# Altium project SSLMainPCB VIII.PrjPcb
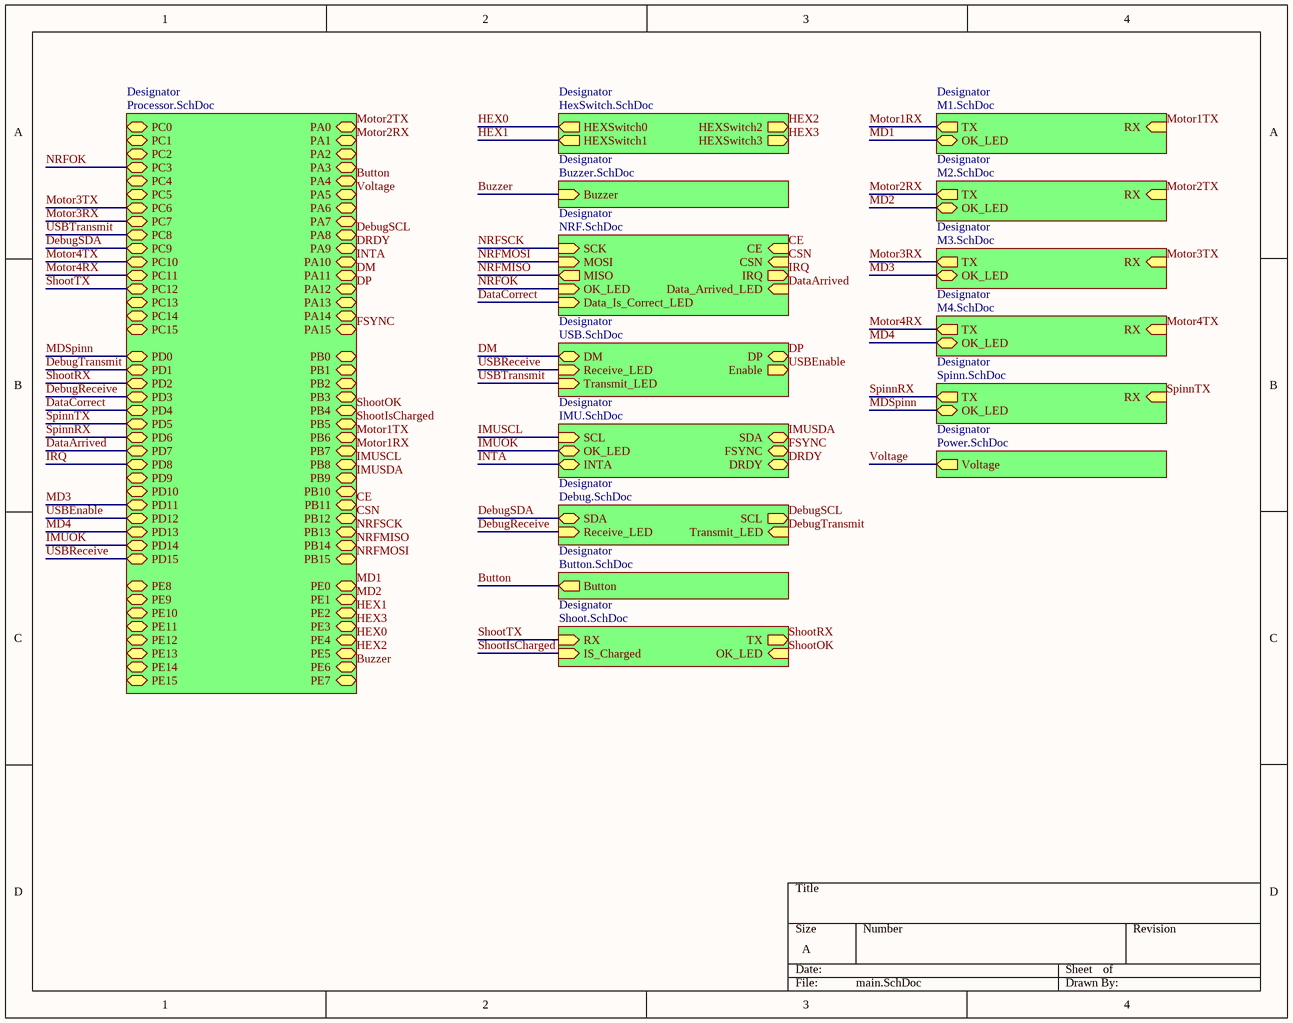
[diagram p0: main.SchDoc]
20 sheets, 167 parts. Net scope: hierarchical (ports join the sheet entries above them; power ports are global).
Board files: main.PcbDoc, Sheet.PcbDoc
Sheets:
  main.SchDoc
    Designator = Processor.SchDoc
      Designator = STLink.SchDoc
      Designator = Boot.SchDoc
      Designator = Reset.SchDoc
      Designator = Xtal.SchDoc
    Designator = HexSwitch.SchDoc
    Designator = Buzzer.SchDoc
    Designator = NRF.SchDoc
    Designator = USB.SchDoc
    Designator = IMU.SchDoc
    Designator = Button.SchDoc
    Designator = Debug.SchDoc
    Designator = Shoot.SchDoc
    Designator = M1.SchDoc
    Designator = M2.SchDoc
    Designator = M3.SchDoc
    Designator = M4.SchDoc
    Designator = Spinn.SchDoc
    Designator = Power.SchDoc

## Sheet main.SchDoc: SSLMainPCB VIII
size A

### Sub-sheets
Designator = Processor.SchDoc: PA0 (bidir), PA1 (bidir), PA2 (bidir), PA3 (bidir), PA4 (bidir), PA5 (bidir), PA6 (bidir), PA7 (bidir), PA8 (bidir), PA9 (bidir), PA10 (bidir), PA11 (bidir), PA12 (bidir), PA13 (bidir), PA14 (bidir), PA15 (bidir), PB0 (bidir), PB1 (bidir), PB2 (bidir), PB3 (bidir), PB4 (bidir), PB5 (bidir), PB6 (bidir), PB7 (bidir), PB8 (bidir), PB9 (bidir), PB10 (bidir), PB11 (bidir), PB12 (bidir), PB13 (bidir), PB14 (bidir), PB15 (bidir), PC0 (bidir), PC1 (bidir), PC2 (bidir), PC3 (bidir), PC4 (bidir), PC5 (bidir), PC6 (bidir), PC7 (bidir), PC8 (bidir), PC9 (bidir), PC10 (bidir), PC11 (bidir), PC12 (bidir), PC13 (bidir), PC14 (bidir), PC15 (bidir), PD0 (bidir), PD1 (bidir), PD2 (bidir), PD3 (bidir), PD4 (bidir), PD5 (bidir), PD6 (bidir), PD7 (bidir), PD8 (bidir), PD9 (bidir), PD10 (bidir), PD11 (bidir), PD12 (bidir), PD13 (bidir), PD14 (bidir), PD15 (bidir), PE1 (bidir), PE2 (bidir), PE3 (bidir), PE4 (bidir), PE5 (bidir), PE6 (bidir), PE7 (bidir), PE8 (bidir), PE9 (bidir), PE10 (bidir), PE11 (bidir), PE12 (bidir), PE13 (bidir), PE14 (bidir), PE15 (bidir), PE0 (bidir)
Designator = HexSwitch.SchDoc: HEXSwitch0 (out), HEXSwitch1 (out), HEXSwitch2 (out), HEXSwitch3 (out)
Designator = Buzzer.SchDoc: Buzzer (in)
Designator = NRF.SchDoc: SCK (in), MOSI (in), MISO (out), CE (in), CSN (in), IRQ (out), OK_LED (in), Data_Is_Correct_LED (in), Data_Arrived_LED (in)
Designator = USB.SchDoc: DM (bidir), DP (bidir), Receive_LED (in), Transmit_LED (in), Enable (out)
Designator = IMU.SchDoc: SCL (in), SDA, OK_LED, INTA, FSYNC, DRDY
Designator = Button.SchDoc: Button (out)
Designator = Debug.SchDoc: SDA (bidir), SCL (out), Receive_LED (in), Transmit_LED (in)
Designator = Shoot.SchDoc: RX (in), IS_Charged (in), TX (out), OK_LED (in)
Designator = M1.SchDoc: TX (out), OK_LED, RX (in)
Designator = M2.SchDoc: TX (out), OK_LED, RX (in)
Designator = M3.SchDoc: TX (out), OK_LED, RX (in)
Designator = M4.SchDoc: TX (out), OK_LED, RX (in)
Designator = Spinn.SchDoc: TX (out), OK_LED, RX (in)
Designator = Power.SchDoc: Voltage (out)

### Nets
Button: sheet Designator/PA4, sheet Designator/Button
Buzzer: sheet Designator/PE6, sheet Designator/Buzzer
CE: sheet Designator/PB11, sheet Designator/CE
CSN: sheet Designator/PB12, sheet Designator/CSN
DataArrived: sheet Designator/PD7, sheet Designator/Data_Arrived_LED
DataCorrect: sheet Designator/PD4, sheet Designator/Data_Is_Correct_LED
DebugReceive: sheet Designator/PD3, sheet Designator/Receive_LED
DebugSCL: sheet Designator/PA8, sheet Designator/SCL
DebugSDA: sheet Designator/PC9, sheet Designator/SDA
DebugTransmit: sheet Designator/PD1, sheet Designator/Transmit_LED
DM: sheet Designator/PA11, sheet Designator/DM
DP: sheet Designator/PA12, sheet Designator/DP
DRDY: sheet Designator/PA9, sheet Designator/DRDY
FSYNC: sheet Designator/PA15, sheet Designator/FSYNC
HEX0: sheet Designator/PE4, sheet Designator/HEXSwitch0
HEX1: sheet Designator/PE2, sheet Designator/HEXSwitch1
HEX2: sheet Designator/PE5, sheet Designator/HEXSwitch2
HEX3: sheet Designator/PE3, sheet Designator/HEXSwitch3
IMUOK: sheet Designator/PD14, sheet Designator/OK_LED
IMUSCL: sheet Designator/PB8, sheet Designator/SCL
IMUSDA: sheet Designator/PB9, sheet Designator/SDA
INTA: sheet Designator/PA10, sheet Designator/INTA
IRQ: sheet Designator/PD8, sheet Designator/IRQ
MD1: sheet Designator/PE0, sheet Designator/OK_LED
MD2: sheet Designator/PE1, sheet Designator/OK_LED
MD3: sheet Designator/PD11, sheet Designator/OK_LED
MD4: sheet Designator/PD13, sheet Designator/OK_LED
MDSpinn: sheet Designator/PD0, sheet Designator/OK_LED
Motor1RX: sheet Designator/PB7, sheet Designator/TX
Motor1TX: sheet Designator/PB6, sheet Designator/RX
Motor2RX: sheet Designator/PA1, sheet Designator/TX
Motor2TX: sheet Designator/PA0, sheet Designator/RX
Motor3RX: sheet Designator/PC7, sheet Designator/TX
Motor3TX: sheet Designator/PC6, sheet Designator/RX
Motor4RX: sheet Designator/PC11, sheet Designator/TX
Motor4TX: sheet Designator/PC10, sheet Designator/RX
NRFMISO: sheet Designator/PB14, sheet Designator/MISO  [project net MISO]
NRFMOSI: sheet Designator/PB15, sheet Designator/MOSI  [project net MOSI]
NRFOK: sheet Designator/PC3, sheet Designator/OK_LED
NRFSCK: sheet Designator/PB13, sheet Designator/SCK
ShootIsCharged: sheet Designator/PB5, sheet Designator/IS_Charged
ShootOK: sheet Designator/PB4, sheet Designator/OK_LED
ShootRX: sheet Designator/PD2, sheet Designator/TX
ShootTX: sheet Designator/PC12, sheet Designator/RX  [project net RX]
SpinnRX: sheet Designator/PD6, sheet Designator/TX
SpinnTX: sheet Designator/PD5, sheet Designator/RX  [project net RX]
USBEnable: sheet Designator/PD12, sheet Designator/Enable
USBReceive: sheet Designator/PD15, sheet Designator/Receive_LED
USBTransmit: sheet Designator/PC8, sheet Designator/Transmit_LED
Voltage: sheet Designator/PA5, sheet Designator/Voltage

## Sheet Processor.SchDoc
size A
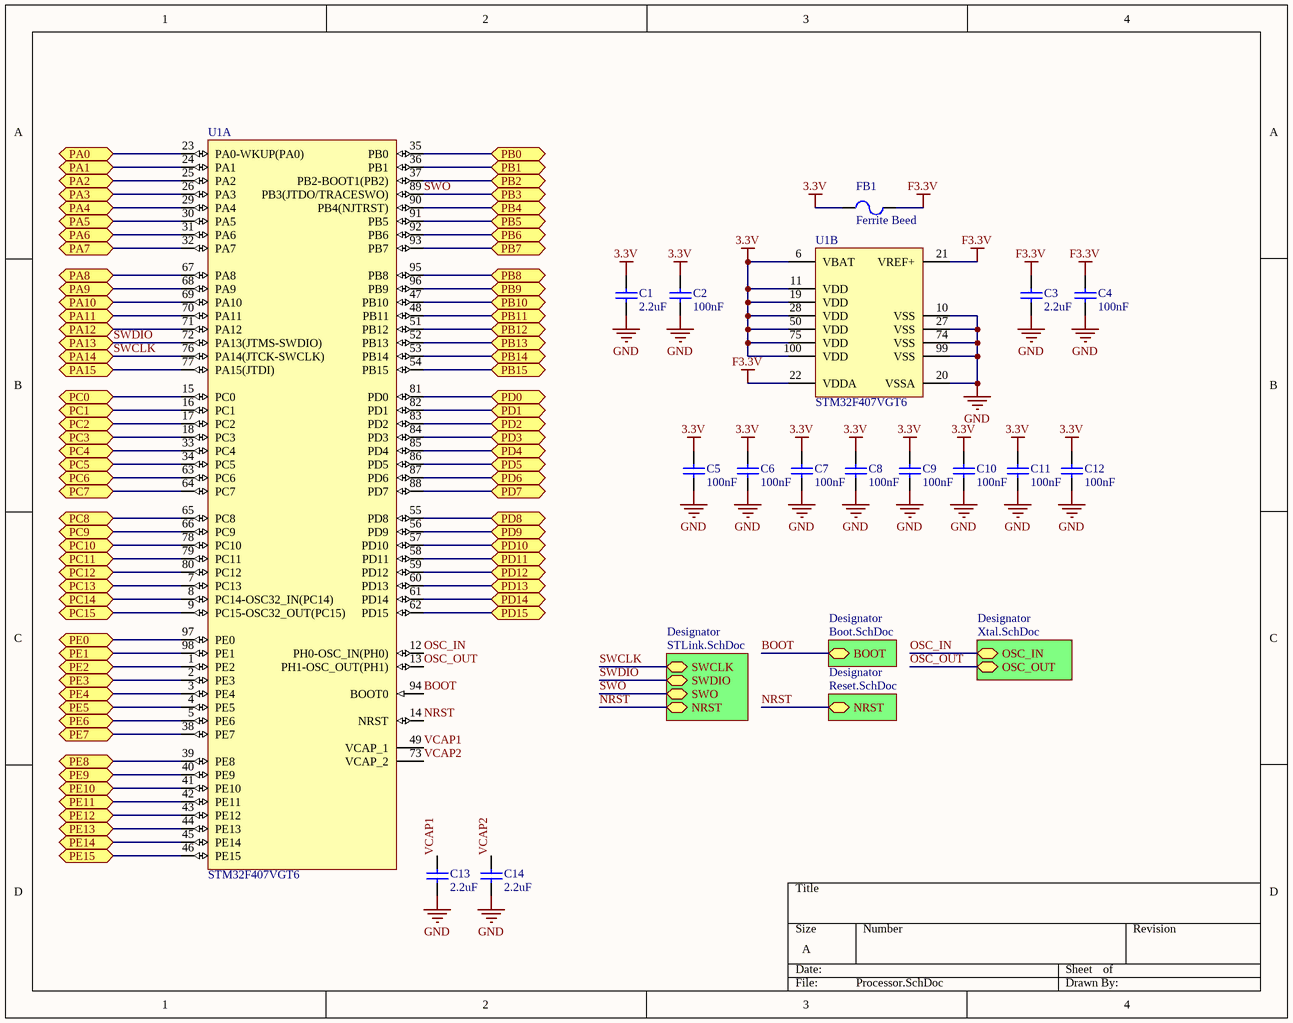
[diagram p1: Processor.SchDoc]

### Parts
C1  value 2.2uF  [2012[0805]]  (hidden comment: Cap_UP)
C2  value 100nF  [2012[0805]]  (hidden comment: Cap_UP)
C3  value 2.2uF  [2012[0805]]  (hidden comment: Cap_UP)
C4  value 100nF  [2012[0805]]  (hidden comment: Cap_UP)
C5  value 100nF  [2012[0805]]  (hidden comment: Cap_UP)
C6  value 100nF  [2012[0805]]  (hidden comment: Cap_UP)
C7  value 100nF  [2012[0805]]  (hidden comment: Cap_UP)
C8  value 100nF  [2012[0805]]  (hidden comment: Cap_UP)
C9  value 100nF  [2012[0805]]  (hidden comment: Cap_UP)
C10  value 100nF  [2012[0805]]  (hidden comment: Cap_UP)
C11  value 100nF  [2012[0805]]  (hidden comment: Cap_UP)
C12  value 100nF  [2012[0805]]  (hidden comment: Cap_UP)
C13  value 2.2uF  [2012[0805]]  (hidden comment: Cap_UP)
C14  value 2.2uF  [2012[0805]]  (hidden comment: Cap_UP)
FB1  Ferrite Beed  [3216[1206]]
U1  STM32F407VGT6  [STM-LQFP100_N]  (parts A,B of 2)

### Sub-sheets
Designator = STLink.SchDoc: SWCLK, SWDIO, SWO, NRST
Designator = Boot.SchDoc: BOOT
Designator = Reset.SchDoc: NRST
Designator = Xtal.SchDoc: OSC_IN, OSC_OUT

### Ports
PA0 (bidir), PA1 (bidir), PA2 (bidir), PA3 (bidir), PA4 (bidir), PA5 (bidir), PA6 (bidir), PA7 (bidir), PA8 (bidir), PA9 (bidir), PA10 (bidir), PA11 (bidir), PA12 (bidir), PA13 (bidir), PA14 (bidir), PA15 (bidir), PB0 (bidir), PB1 (bidir), PB2 (bidir), PB3 (bidir), PB4 (bidir), PB5 (bidir), PB6 (bidir), PB7 (bidir), PB8 (bidir), PB9 (bidir), PB10 (bidir), PB11 (bidir), PB12 (bidir), PB13 (bidir), PB14 (bidir), PB15 (bidir), PC0 (bidir), PC1 (bidir), PC2 (bidir), PC3 (bidir), PC4 (bidir), PC5 (bidir), PC6 (bidir), PC7 (bidir), PC8 (bidir), PC9 (bidir), PC10 (bidir), PC11 (bidir), PC12 (bidir), PC13 (bidir), PC14 (bidir), PC15 (bidir), PD0 (bidir), PD1 (bidir), PD2 (bidir), PD3 (bidir), PD4 (bidir), PD5 (bidir), PD6 (bidir), PD7 (bidir), PD8 (bidir), PD9 (bidir), PD10 (bidir), PD11 (bidir), PD12 (bidir), PD13 (bidir), PD14 (bidir), PD15 (bidir), PE0 (bidir), PE1 (bidir), PE2 (bidir), PE3 (bidir), PE4 (bidir), PE5 (bidir), PE6 (bidir), PE7 (bidir), PE8 (bidir), PE9 (bidir), PE10 (bidir), PE11 (bidir), PE12 (bidir), PE13 (bidir), PE14 (bidir), PE15 (bidir)

### Nets
3.3V: C1.2 C2.2 C5.2 C6.2 C7.2 C8.2 C9.2 C10.2 C11.2 C12.2 FB1.1 U1.6(VBAT) U1.11(VDD) U1.19(VDD) U1.28(VDD) U1.50(VDD) U1.75(VDD) U1.100(VDD)
F3.3V: C3.2 C4.2 FB1.2 U1.21(VREF+) U1.22(VDDA)
GND: C1.1 C2.1 C3.1 C4.1 C5.1 C6.1 C7.1 C8.1 C9.1 C10.1 C11.1 C12.1 C13.1 C14.1 U1.10(VSS) U1.20(VSSA) U1.27(VSS) U1.74(VSS) U1.99(VSS)
BOOT: U1.94(BOOT0) ; sheet Designator/BOOT
Button: U1.29(PA4) ; port PA4
Buzzer: U1.5(PE6) ; port PE6
CE: U1.48(PB11) ; port PB11
CSN: U1.51(PB12) ; port PB12
DataArrived: U1.88(PD7) ; port PD7
DataCorrect: U1.85(PD4) ; port PD4
DebugReceive: U1.84(PD3) ; port PD3
DebugSCL: U1.67(PA8) ; port PA8
DebugSDA: U1.66(PC9) ; port PC9
DebugTransmit: U1.82(PD1) ; port PD1
DM: U1.70(PA11) ; port PA11
DP: U1.71(PA12) ; port PA12
DRDY: U1.68(PA9) ; port PA9
FSYNC: U1.77(PA15(JTDI)) ; port PA15
HEX0: U1.3(PE4) ; port PE4
HEX1: U1.1(PE2) ; port PE2
HEX2: U1.4(PE5) ; port PE5
HEX3: U1.2(PE3) ; port PE3
IMUOK: U1.61(PD14) ; port PD14
IMUSCL: U1.95(PB8) ; port PB8
IMUSDA: U1.96(PB9) ; port PB9
INTA: U1.69(PA10) ; port PA10
IRQ: U1.55(PD8) ; port PD8
MD1: U1.97(PE0) ; port PE0
MD2: U1.98(PE1) ; port PE1
MD3: U1.58(PD11) ; port PD11
MD4: U1.60(PD13) ; port PD13
MDSpinn: U1.81(PD0) ; port PD0
MISO: U1.53(PB14) ; port PB14
MOSI: U1.54(PB15) ; port PB15
Motor1RX: U1.93(PB7) ; port PB7
Motor1TX: U1.92(PB6) ; port PB6
Motor2RX: U1.24(PA1) ; port PA1
Motor2TX: U1.23(PA0-WKUP(PA0)) ; port PA0
Motor3RX: U1.64(PC7) ; port PC7
Motor3TX: U1.63(PC6) ; port PC6
Motor4RX: U1.79(PC11) ; port PC11
Motor4TX: U1.78(PC10) ; port PC10
NRFOK: U1.18(PC3) ; port PC3
NRFSCK: U1.52(PB13) ; port PB13
NRST: U1.14(NRST) ; sheet Designator/NRST, sheet Designator/NRST
OSC_IN: U1.12(PH0-OSC_IN(PH0)) ; sheet Designator/OSC_IN
OSC_OUT: U1.13(PH1-OSC_OUT(PH1)) ; sheet Designator/OSC_OUT
RX: U1.80(PC12) ; port PC12
RX: U1.86(PD5) ; port PD5  [a separate net that carries the same name]
ShootIsCharged: U1.91(PB5) ; port PB5
ShootOK: U1.90(PB4(NJTRST)) ; port PB4
ShootRX: U1.83(PD2) ; port PD2
SpinnRX: U1.87(PD6) ; port PD6
SWCLK: U1.76(PA14(JTCK-SWCLK)) ; port PA14, sheet Designator/SWCLK
SWDIO: U1.72(PA13(JTMS-SWDIO)) ; port PA13, sheet Designator/SWDIO
SWO: U1.89(PB3(JTDO/TRACESWO)) ; port PB3, sheet Designator/SWO
USBEnable: U1.59(PD12) ; port PD12
USBReceive: U1.62(PD15) ; port PD15
USBTransmit: U1.65(PC8) ; port PC8
VCAP1: C13.2 U1.49(VCAP_1)
VCAP2: C14.2 U1.73(VCAP_2)
Voltage: U1.30(PA5) ; port PA5
NetU1_7: U1.7(PC13) ; port PC13
NetU1_8: U1.8(PC14-OSC32_IN(PC14)) ; port PC14
NetU1_9: U1.9(PC15-OSC32_OUT(PC15)) ; port PC15
NetU1_15: U1.15(PC0) ; port PC0
NetU1_16: U1.16(PC1) ; port PC1
NetU1_17: U1.17(PC2) ; port PC2
NetU1_25: U1.25(PA2) ; port PA2
NetU1_26: U1.26(PA3) ; port PA3
NetU1_31: U1.31(PA6) ; port PA6
NetU1_32: U1.32(PA7) ; port PA7
NetU1_33: U1.33(PC4) ; port PC4
NetU1_34: U1.34(PC5) ; port PC5
NetU1_35: U1.35(PB0) ; port PB0
NetU1_36: U1.36(PB1) ; port PB1
NetU1_37: U1.37(PB2-BOOT1(PB2)) ; port PB2
NetU1_38: U1.38(PE7) ; port PE7
NetU1_39: U1.39(PE8) ; port PE8
NetU1_40: U1.40(PE9) ; port PE9
NetU1_41: U1.41(PE10) ; port PE10
NetU1_42: U1.42(PE11) ; port PE11
NetU1_43: U1.43(PE12) ; port PE12
NetU1_44: U1.44(PE13) ; port PE13
NetU1_45: U1.45(PE14) ; port PE14
NetU1_46: U1.46(PE15) ; port PE15
NetU1_47: U1.47(PB10) ; port PB10
NetU1_56: U1.56(PD9) ; port PD9
NetU1_57: U1.57(PD10) ; port PD10

### Library data of the parts
C1-C14 = Cap_UP: Capacitor; Published: 8-Jun-2000; LatestRevisionDate: 17-Jul-2002; LatestRevisionNote: Re-released for DXP Platform.; PackageReference: RAD-0.3; Publisher: Altium Limited
FB1 = Ferrite Beed: Code_IEC: 1005; Published: 8-Jun-2000; LatestRevisionDate: 17-Jul-2002; LatestRevisionNote: Re-released for DXP Platform.; PackageReference: 0402-A; Publisher: Altium Limited; Code_JEITA: 0402
U1 = STM32F407VGT6: ARM Cortex-M4 32-bit MCU+FPU, 210 DMIPS, 1024 kB Flash, 192 kB Internal RAM, 82 I/Os, 100-pin LQFP, -40 to 85 degC, Tray; Manufacturer: STMicroelectronics; D/A Converter: 2x12-bit; FLASH Size (Prog) (kB): 1024; I/Os (High Current): 82; Internal RAM Size (kB): 192; Operating Frequency(F) (Processor speed) (MHz): 168; Supply Voltage(Vcc) max (V): 3.6; Supply Voltage(Vcc) min (V): 1.8; DatasheetVersion: Rev. 4; PackageVersion: Rev. 1, 06/2013; PackageReference: LQFP100; PackageDescription: 100-Pin Low Profile Quad Flat Package, 14 x 14 mm Body, 0.5 mm Pitch; Supplier 1: Digi-Key; Supplier Part Number 1: 497-11605-ND; Supplier 2: Farnell; Supplier Part Number 2: 2064368; Supplier 3: Newark; Supplier Part Number 3: 73T2333; Supplier 4: Mouser; Supplier Part Number 4: 511-STM32F407VGT6; Core: ARM Cortex-M4; Packing: Tray; Mounting Technology: Surface Mount; PartNumber: STM32F407VGT6; ComponentLink1Description: Manufacturer URL; ComponentLink1URL: http://www.st.com/web/en/home.html; ComponentLink2Description: Datasheet; ComponentLink2URL: http://www.st.com/st-web-ui/static/active/en/resource/technical/document/datasheet/DM00037051.pdf; ComponentLink3Description: Package Specification; ComponentLink3URL: http://www.st.com/st-web-ui/static/active/en/resource/technical/document/data_brief/DM00071938.pdf

## Sheet STLink.SchDoc
size A
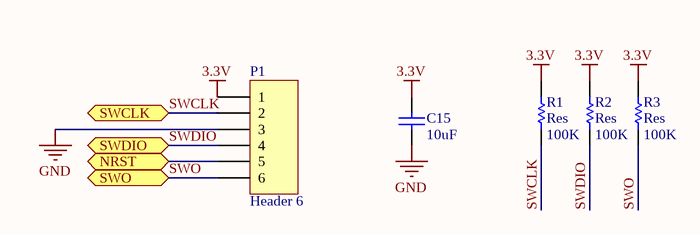
[diagram p2: STLink.SchDoc]

### Parts
C15  value 10uF  [2012[0805]]  (hidden comment: Cap_UP)
P1  Header 6  [HDR1X6]
R1  Res  value 100K  [2012[0805]]
R2  Res  value 100K  [2012[0805]]
R3  Res  value 100K  [2012[0805]]

### Ports
NRST, SWCLK, SWDIO, SWO

### Nets
3.3V: C15.2 P1.1 R1.2 R2.2 R3.2
GND: C15.1 P1.3
NRST: P1.5 ; port NRST
SWCLK: P1.2 R1.1 ; port SWCLK
SWDIO: P1.4 R2.1 ; port SWDIO
SWO: P1.6 R3.1 ; port SWO

### Library data of the parts
C15 = Cap_UP: Capacitor; Published: 8-Jun-2000; LatestRevisionDate: 17-Jul-2002; LatestRevisionNote: Re-released for DXP Platform.; PackageReference: RAD-0.3; Publisher: Altium Limited
P1 = Header 6: Header, 6-Pin; LatestRevisionDate: 17-Jul-2002; LatestRevisionNote: Re-released for DXP Platform.; Publisher: Altium Limited
R1-R3 = Res: Semiconductor Resistor; Published: 8-Jun-2000; LatestRevisionDate: 17-Jul-2002; LatestRevisionNote: Re-released for DXP Platform.; PackageReference: AXIAL-0.5; Publisher: Altium Limited

## Sheet Boot.SchDoc
size A
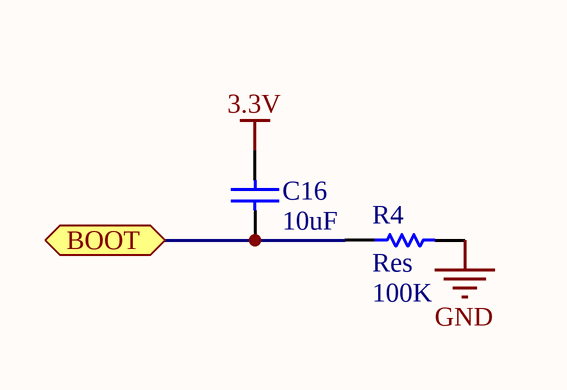
[diagram p3: Boot.SchDoc]

### Parts
C16  value 10uF  [2012[0805]]  (hidden comment: Cap_UP)
R4  Res  value 100K  [2012[0805]]

### Ports
BOOT (bidir)

### Nets
3.3V: C16.1
GND: R4.2
BOOT: C16.2 R4.1 ; port BOOT

### Library data of the parts
C16 = Cap_UP: Capacitor; Published: 8-Jun-2000; LatestRevisionDate: 17-Jul-2002; LatestRevisionNote: Re-released for DXP Platform.; PackageReference: RAD-0.3; Publisher: Altium Limited
R4 = Res: Semiconductor Resistor; Published: 8-Jun-2000; LatestRevisionDate: 17-Jul-2002; LatestRevisionNote: Re-released for DXP Platform.; PackageReference: AXIAL-0.5; Publisher: Altium Limited

## Sheet Reset.SchDoc
size A
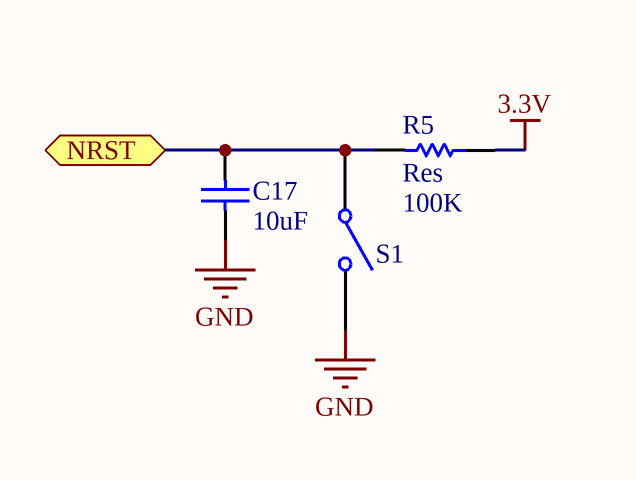
[diagram p4: Reset.SchDoc]

### Parts
C17  value 10uF  [2012[0805]]  (hidden comment: Cap_UP)
R5  Res  value 100K  [2012[0805]]
S1  SW-SPST  [SW-SMD]  (value not drawn)

### Ports
NRST

### Nets
3.3V: R5.1
GND: C17.1 S1.2(NO)
NRST: C17.2 R5.2 S1.1(COMMON) ; port NRST

### Library data of the parts
C17 = Cap_UP: Capacitor; Published: 8-Jun-2000; LatestRevisionDate: 17-Jul-2002; LatestRevisionNote: Re-released for DXP Platform.; PackageReference: RAD-0.3; Publisher: Altium Limited
R5 = Res: Semiconductor Resistor; Published: 8-Jun-2000; LatestRevisionDate: 17-Jul-2002; LatestRevisionNote: Re-released for DXP Platform.; PackageReference: AXIAL-0.5; Publisher: Altium Limited
S1 = SW-SPST: Single-Pole, Single-Throw Switch; Published: 24-Mar-1999; Revision: July-2002: Re-released for DXP Platform.; Publisher: Altium Limited

## Sheet Xtal.SchDoc
size A
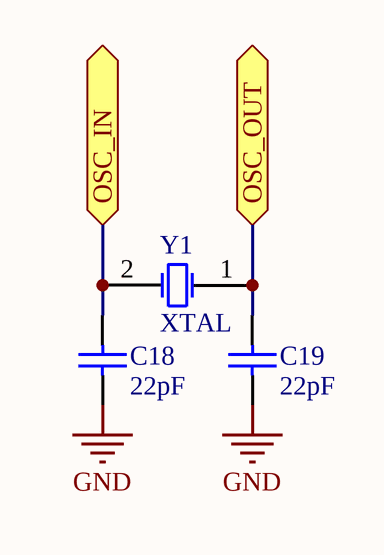
[diagram p5: Xtal.SchDoc]

### Parts
C18  value 22pF  [2012[0805]]  (hidden comment: Cap_UP)
C19  value 22pF  [2012[0805]]  (hidden comment: Cap_UP)
Y1  XTAL  [XTALL]

### Ports
OSC_IN, OSC_OUT

### Nets
GND: C18.2 C19.2
OSC_IN: C18.1 Y1.2(OSC2) ; port OSC_IN
OSC_OUT: C19.1 Y1.1(OSC1) ; port OSC_OUT

### Library data of the parts
C18 C19 = Cap_UP: Capacitor; Published: 8-Jun-2000; LatestRevisionDate: 17-Jul-2002; LatestRevisionNote: Re-released for DXP Platform.; PackageReference: RAD-0.3; Publisher: Altium Limited
Y1 = XTAL: Crystal Oscillator; Published: 8-Jun-2000; LatestRevisionDate: 17-Jul-2002; LatestRevisionNote: Re-released for DXP Platform.; PackageReference: R38; Publisher: Altium Limited

## Sheet HexSwitch.SchDoc
size A
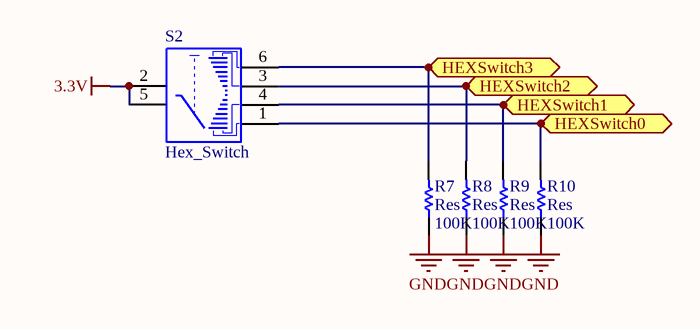
[diagram p6: HexSwitch.SchDoc]

### Parts
R7  Res  value 100K  [2012[0805]]
R8  Res  value 100K  [2012[0805]]
R9  Res  value 100K  [2012[0805]]
R10  Res  value 100K  [2012[0805]]
S2  Hex_Switch  [SW-HEX]

### Ports
HEXSwitch0 (out), HEXSwitch1 (out), HEXSwitch2 (out), HEXSwitch3 (out)

### Nets
3.3V: S2.2 S2.5
GND: R7.1 R8.1 R9.1 R10.1
HEX0: R10.2 S2.1 ; port HEXSwitch0
HEX1: R9.2 S2.4 ; port HEXSwitch1
HEX2: R8.2 S2.3 ; port HEXSwitch2
HEX3: R7.2 S2.6 ; port HEXSwitch3

### Library data of the parts
R7-R10 = Res: Semiconductor Resistor; Published: 8-Jun-2000; LatestRevisionDate: 17-Jul-2002; LatestRevisionNote: Re-released for DXP Platform.; PackageReference: AXIAL-0.5; Publisher: Altium Limited
S2 = SW-Hex: Published: 24-Mar-1999; LatestRevisionDate: 17-Jul-2002; LatestRevisionNote: Re-released for DXP Platform.; PackageReference: DIP-8; Publisher: Altium Limited

## Sheet Buzzer.SchDoc
size A
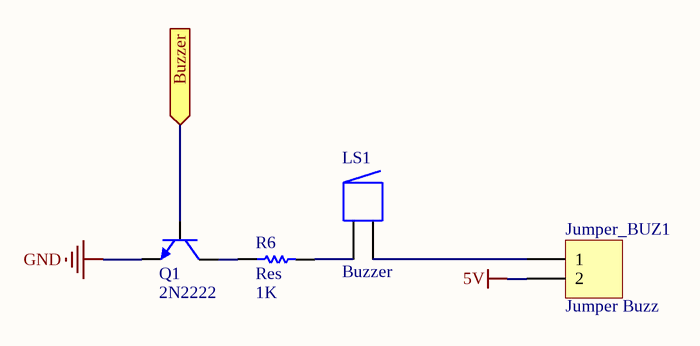
[diagram p7: Buzzer.SchDoc]

### Parts
Jumper_BUZ1  Jumper Buzz  [HDR1X2]
LS1  Buzzer  [BUZZER]
Q1  2N2222  [SOT-23]
R6  Res  value 1K  [2012[0805]]

### Ports
Buzzer (in)

### Nets
5V: Jumper_BUZ1.2
GND: Q1.3(E)
Buzzer: Q1.2(B) ; port Buzzer
NetJumper_BUZ1_1: Jumper_BUZ1.1 LS1.2
NetLS1_1: LS1.1 R6.2
NetQ1_1: Q1.1(C) R6.1

### Library data of the parts
Jumper_BUZ1 = Header 2: Header, 2-Pin; LatestRevisionDate: 17-Jul-2002; LatestRevisionNote: Re-released for DXP Platform.; Publisher: Altium Limited
LS1 = Buzzer: Magnetic Transducer Buzzer; Published: 24-Mar-1999; LatestRevisionDate: 17-Dec-2003; LatestRevisionNote: Schematic revised, PCB Footprint replaced.; DatasheetDocument: 17-Dec-2003; PackageReference: ABSM-1574; Publisher: Altium Limited; ComponentLink1Description: Manufacturer Link; ComponentLink1URL: http://www.megastar.com/linecard/buzzmode/index.php
Q1 = 2N2222: NPN Bipolar Transistor; Published: 8-Jun-2000; LatestRevisionDate: 17-Jul-2002; LatestRevisionNote: Re-released for DXP Platform.; PackageReference: TO-226; Publisher: Altium Limited; Code_JEDEC: TO-226-AA
R6 = Res: Semiconductor Resistor; Published: 8-Jun-2000; LatestRevisionDate: 17-Jul-2002; LatestRevisionNote: Re-released for DXP Platform.; PackageReference: AXIAL-0.5; Publisher: Altium Limited

## Sheet NRF.SchDoc
size A
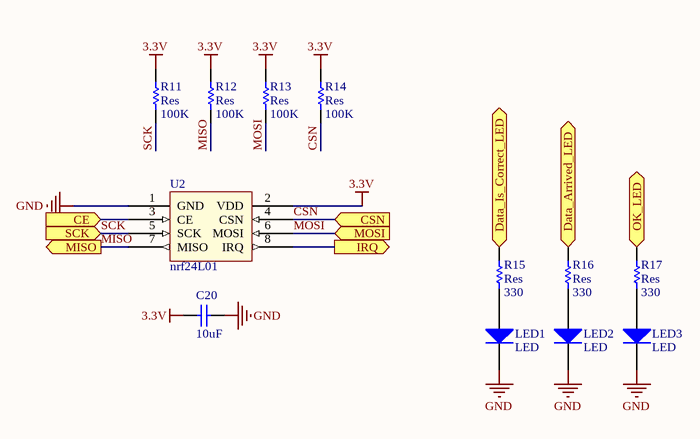
[diagram p8: NRF.SchDoc]

### Parts
C20  value 10uF  [2012[0805]]  (hidden comment: Cap_UP)
LED1  LED  [2012[0805]]
LED2  LED  [2012[0805]]
LED3  LED  [2012[0805]]
R11  Res  value 100K  [2012[0805]]
R12  Res  value 100K  [2012[0805]]
R13  Res  value 100K  [2012[0805]]
R14  Res  value 100K  [2012[0805]]
R15  Res  value 330  [2012[0805]]
R16  Res  value 330  [2012[0805]]
R17  Res  value 330  [2012[0805]]
U2  nrf24L01  [NRF24L01]

### Ports
CE (in), CSN (in), Data_Arrived_LED (in), Data_Is_Correct_LED (in), IRQ (out), MISO (out), MOSI (in), OK_LED (in), SCK (in)

### Nets
3.3V: C20.2 R11.2 R12.2 R13.2 R14.2 U2.2(VDD)
GND: C20.1 LED1.2(K) LED2.2(K) LED3.2(K) U2.1(GND)
CE: U2.3(CE) ; port CE
CSN: R14.1 U2.4(CSN) ; port CSN
DataArrived: R16.1 ; port Data_Arrived_LED
DataCorrect: R15.1 ; port Data_Is_Correct_LED
IRQ: U2.8(IRQ) ; port IRQ
MISO: R12.1 U2.7(MISO) ; port MISO
MOSI: R13.1 U2.6(MOSI) ; port MOSI
NRFOK: R17.1 ; port OK_LED
SCK: R11.1 U2.5(SCK) ; port SCK  [project net NRFSCK]
NetLED1_1: LED1.1(A) R15.2
NetLED2_1: LED2.1(A) R16.2
NetLED3_1: LED3.1(A) R17.2

### Library data of the parts
C20 = Cap_UP: Capacitor; Published: 8-Jun-2000; LatestRevisionDate: 17-Jul-2002; LatestRevisionNote: Re-released for DXP Platform.; PackageReference: RAD-0.3; Publisher: Altium Limited
LED1-LED3 = Diode: 1 Amp General Purpose Rectifier; Revision 1: 11-Jul-2000: SIM Model Added.; Revision 2: 17-Jul-2002: Re-released for DXP Platform.; Package Information: Latest Revision: Aug-1999; Code - JEDEC: DO-204-AL; Published: 8-Jun-2000; Datasheet: Latest Revision: 1998; Package Reference: DO-41; Publisher: Altium Limited
R11-R17 = Res: Semiconductor Resistor; Published: 8-Jun-2000; LatestRevisionDate: 17-Jul-2002; LatestRevisionNote: Re-released for DXP Platform.; PackageReference: AXIAL-0.5; Publisher: Altium Limited

## Sheet USB.SchDoc
size A
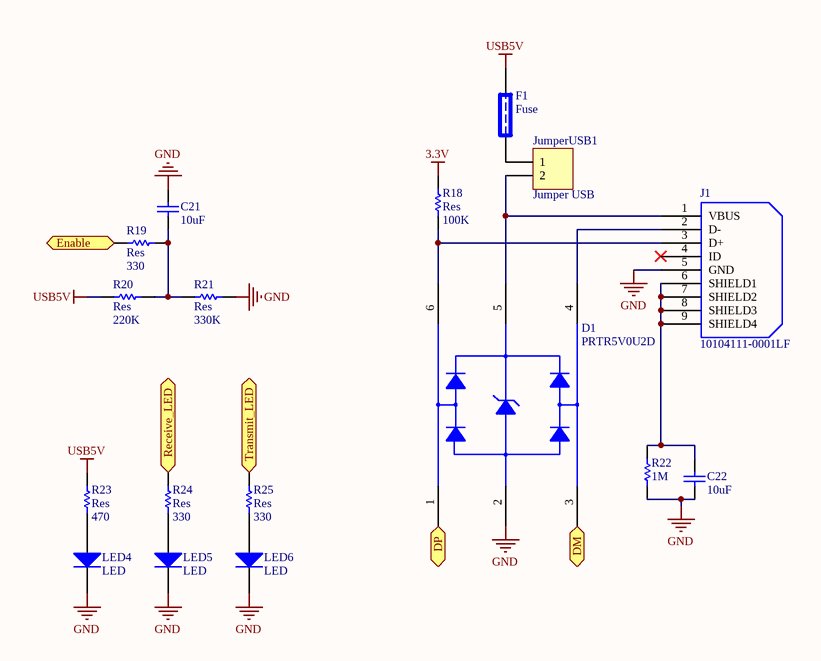
[diagram p9: USB.SchDoc]

### Parts
C21  value 10uF  [2012[0805]]  (hidden comment: Cap_UP)
C22  value 10uF  [2012[0805]]  (hidden comment: Cap_UP)
D1  value PRTR5V0U2D  [PRTR5V0U2D]  (hidden comment: PRTR5V0U2X)
F1  Fuse  [3216[1206]]
J1  value 10104111-0001LF  [USB_MINI]  (hidden comment: USB_AB)
JumperUSB1  Jumper USB  [HDR1X2]
LED4  LED  [2012[0805]]
LED5  LED  [2012[0805]]
LED6  LED  [2012[0805]]
R18  Res  value 100K  [2012[0805]]
R19  Res  value 330  [2012[0805]]
R20  Res  value 220K  [2012[0805]]
R21  Res  value 330K  [2012[0805]]
R22  1M  [2012[0805]]
R23  Res  value 470  [2012[0805]]
R24  Res  value 330  [2012[0805]]
R25  Res  value 330  [2012[0805]]

### Ports
DM, DP, Enable (out), Receive_LED (in), Transmit_LED (in)

### Nets
3.3V: R18.1
GND: C21.1 C22.1 D1.2(GND) J1.5(GND) LED4.2(K) LED5.2(K) LED6.2(K) R21.2 R22.1
USB5V: F1.2 R20.1 R23.1
DM: D1.3(I/O2) ; port DM
DP: D1.1(I/O_1) ; port DP
USBEnable: R19.1 ; port Enable
USBReceive: R24.1 ; port Receive_LED
USBTransmit: R25.1 ; port Transmit_LED
NetC21_2: C21.2 R19.2 R20.2 R21.1
NetC22_2: C22.2 J1.6(SHIELD1) J1.7(SHIELD2) J1.8(SHIELD3) J1.9(SHIELD4) R22.2
NetD1_4: D1.4(I/O2) J1.2(D-)
NetD1_5: D1.5(VCC) J1.1(VBUS) JumperUSB1.2
NetD1_6: D1.6(I/O1) J1.3(D+) R18.2
NetF1_1: F1.1 JumperUSB1.1
NetLED4_1: LED4.1(A) R23.2
NetLED5_1: LED5.1(A) R24.2
NetLED6_1: LED6.1(A) R25.2

Not connected (* = marked no-connect by the designer): J1 4(ID)*

### Library data of the parts
C21 C22 = Cap_UP: Capacitor; Published: 8-Jun-2000; LatestRevisionDate: 17-Jul-2002; LatestRevisionNote: Re-released for DXP Platform.; PackageReference: RAD-0.3; Publisher: Altium Limited
D1 = PRTR5V0U2D: Double rail-to-rail USB ESD protection diode; OrcadPartType: Integrated Circuits&Special function&Protection; Manufacturer: Philips; AN: A06-0236; TemperatureRange: -40 to +85 C; PartType: Buy; Height: 1,10000002384186; MPN: PRTR5V0U2X
J1 = USB_AB: Micro USB AB Connector; PartGroup: Mechanical devices,Connectors,USB; Manufacturer: FCI; AN: A08-1368; Height: 2.59999990463257; MPN: 10104111-0001LF
JumperUSB1 = Header 2: Header, 2-Pin; LatestRevisionDate: 17-Jul-2002; LatestRevisionNote: Re-released for DXP Platform.; Publisher: Altium Limited
LED4-LED6 = Diode: as LED1 on sheet NRF; Published: 8-Jun-2000; Datasheet: Latest Revision: 1998; Package Reference: DO-41; Publisher: Altium Limited
R18-R25 = Res: Semiconductor Resistor; Published: 8-Jun-2000; LatestRevisionDate: 17-Jul-2002; LatestRevisionNote: Re-released for DXP Platform.; PackageReference: AXIAL-0.5; Publisher: Altium Limited
  R22: Value: 1M
F1 = Fuse: Published: 8-Jun-2000; LatestRevisionDate: 17-Jul-2002; LatestRevisionNote: Re-released for DXP Platform.; PackageReference: PIN-W2/E2.8; Publisher: Altium Limited

## Sheet IMU.SchDoc
size A
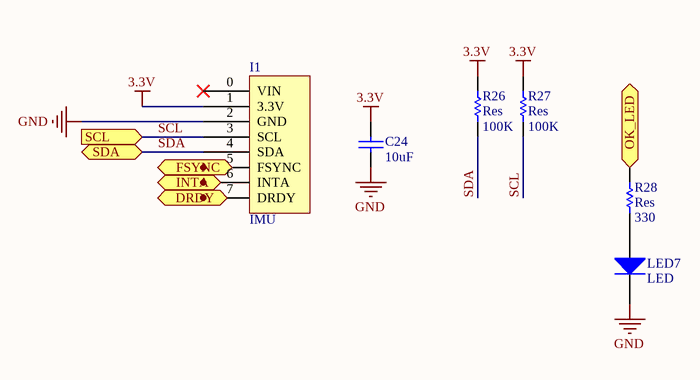
[diagram p10: IMU.SchDoc]

### Parts
C24  value 10uF  [2012[0805]]  (hidden comment: Cap_UP)
I1  IMU  [IMU]
LED7  LED  [2012[0805]]
R26  Res  value 100K  [2012[0805]]
R27  Res  value 100K  [2012[0805]]
R28  Res  value 330  [2012[0805]]

### Ports
DRDY, FSYNC, INTA, OK_LED (in), SCL (in), SDA (bidir)

### Nets
3.3V: C24.2 I1.1(3.3V) R26.2 R27.2
GND: C24.1 I1.2(GND) LED7.2(K)
IMUOK: R28.1 ; port OK_LED
SCL: I1.3(SCL) R27.1 ; port SCL  [project net IMUSCL]
SDA: I1.4(SDA) R26.1 ; port SDA  [project net IMUSDA]
NetLED7_1: LED7.1(A) R28.2

Not connected (* = marked no-connect by the designer): I1 0(VIN)* 5(FSYNC) 6(INTA) 7(DRDY)

### Library data of the parts
C24 = Cap_UP: Capacitor; Published: 8-Jun-2000; LatestRevisionDate: 17-Jul-2002; LatestRevisionNote: Re-released for DXP Platform.; PackageReference: RAD-0.3; Publisher: Altium Limited
LED7 = Diode: as LED1 on sheet NRF; Published: 8-Jun-2000; Datasheet: Latest Revision: 1998; Package Reference: DO-41; Publisher: Altium Limited
R26-R28 = Res: Semiconductor Resistor; Published: 8-Jun-2000; LatestRevisionDate: 17-Jul-2002; LatestRevisionNote: Re-released for DXP Platform.; PackageReference: AXIAL-0.5; Publisher: Altium Limited

## Sheet Button.SchDoc
size A
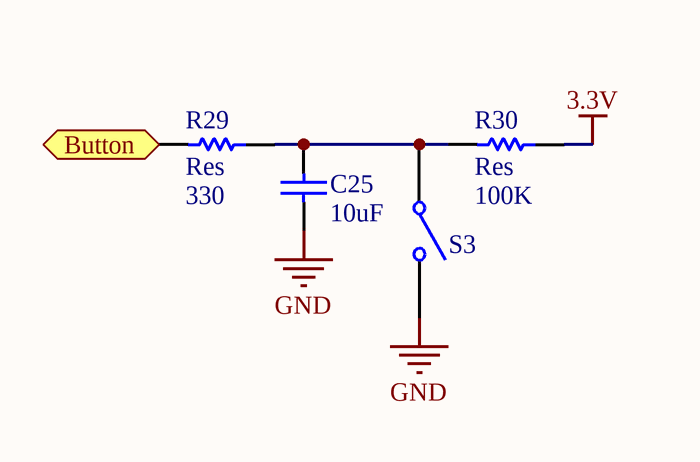
[diagram p11: Button.SchDoc]

### Parts
C25  value 10uF  [2012[0805]]  (hidden comment: Cap_UP)
R29  Res  value 330  [2012[0805]]
R30  Res  value 100K  [2012[0805]]
S3  SW-SPST  [PUSH-BUT]  (value not drawn)

### Ports
Button (out)

### Nets
3.3V: R30.1
GND: C25.1 S3.2(NO)
Button: R29.2 ; port Button
NetC25_2: C25.2 R29.1 R30.2 S3.1(COMMON)

### Library data of the parts
C25 = Cap_UP: Capacitor; Published: 8-Jun-2000; LatestRevisionDate: 17-Jul-2002; LatestRevisionNote: Re-released for DXP Platform.; PackageReference: RAD-0.3; Publisher: Altium Limited
R29 R30 = Res: Semiconductor Resistor; Published: 8-Jun-2000; LatestRevisionDate: 17-Jul-2002; LatestRevisionNote: Re-released for DXP Platform.; PackageReference: AXIAL-0.5; Publisher: Altium Limited
S3 = SW-SPST: Single-Pole, Single-Throw Switch; Published: 24-Mar-1999; Revision: July-2002: Re-released for DXP Platform.; Publisher: Altium Limited

## Sheet Debug.SchDoc
size A
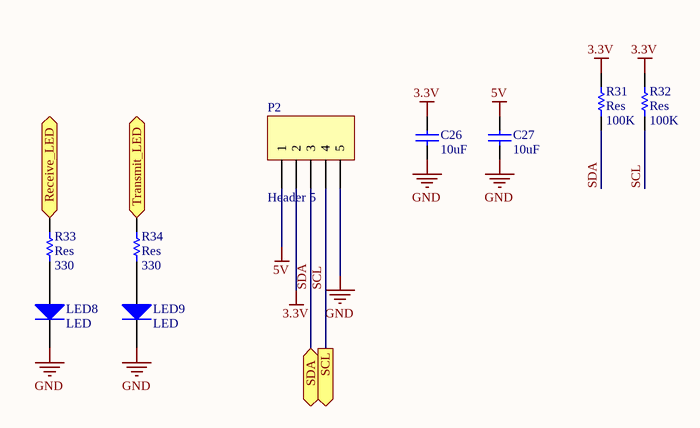
[diagram p12: Debug.SchDoc]

### Parts
C26  value 10uF  [2012[0805]]  (hidden comment: Cap_UP)
C27  value 10uF  [2012[0805]]  (hidden comment: Cap_UP)
LED8  LED  [2012[0805]]
LED9  LED  [2012[0805]]
P2  Header 5  [HDR1X5]
R31  Res  value 100K  [2012[0805]]
R32  Res  value 100K  [2012[0805]]
R33  Res  value 330  [2012[0805]]
R34  Res  value 330  [2012[0805]]

### Ports
Receive_LED (in), SCL (out), SDA (bidir), Transmit_LED (in)

### Nets
3.3V: C26.2 P2.2 R31.2 R32.2
5V: C27.2 P2.1
GND: C26.1 C27.1 LED8.2(K) LED9.2(K) P2.5
DebugReceive: R33.1 ; port Receive_LED
DebugTransmit: R34.1 ; port Transmit_LED
SCL: P2.4 R32.1 ; port SCL  [project net DebugSCL]
SDA: P2.3 R31.1 ; port SDA  [project net DebugSDA]
NetLED8_1: LED8.1(A) R33.2
NetLED9_1: LED9.1(A) R34.2

### Library data of the parts
C26 C27 = Cap_UP: Capacitor; Published: 8-Jun-2000; LatestRevisionDate: 17-Jul-2002; LatestRevisionNote: Re-released for DXP Platform.; PackageReference: RAD-0.3; Publisher: Altium Limited
LED8 LED9 = Diode: as LED1 on sheet NRF; Published: 8-Jun-2000; Datasheet: Latest Revision: 1998; Package Reference: DO-41; Publisher: Altium Limited
P2 = Header 5: Header, 5-Pin; LatestRevisionDate: 17-Jul-2002; LatestRevisionNote: Re-released for DXP Platform.; Publisher: Altium Limited
R31-R34 = Res: Semiconductor Resistor; Published: 8-Jun-2000; LatestRevisionDate: 17-Jul-2002; LatestRevisionNote: Re-released for DXP Platform.; PackageReference: AXIAL-0.5; Publisher: Altium Limited

## Sheet Shoot.SchDoc
size A
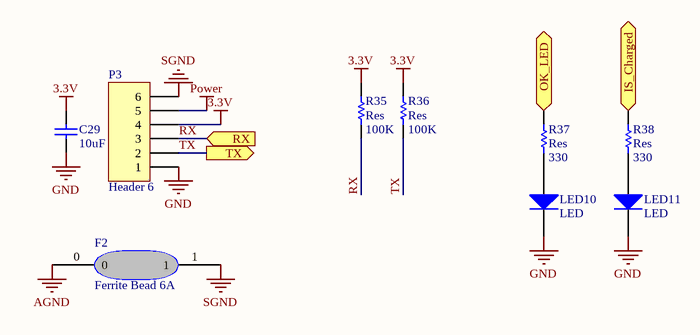
[diagram p13: Shoot.SchDoc]

### Parts
C29  value 10uF  [2012[0805]]  (hidden comment: Cap_UP)
F2  Ferrite Bead 6A  [f6A]
LED10  LED  [2012[0805]]
LED11  LED  [2012[0805]]
P3  Header 6  [HDR1X6]
R35  Res  value 100K  [2012[0805]]
R36  Res  value 100K  [2012[0805]]
R37  Res  value 330  [2012[0805]]
R38  Res  value 330  [2012[0805]]

### Ports
IS_Charged (in), OK_LED (in), RX (in), TX (out)

### Nets
3.3V: C29.2 P3.4 R35.2 R36.2
AGND: F2.0
GND: C29.1 LED10.2(K) LED11.2(K) P3.1
Power: P3.5
SGND: F2.1 P3.6
RX: P3.3 R35.1 ; port RX
ShootIsCharged: R38.1 ; port IS_Charged
ShootOK: R37.1 ; port OK_LED
TX: P3.2 R36.1 ; port TX  [project net ShootRX]
NetLED10_1: LED10.1(A) R37.2
NetLED11_1: LED11.1(A) R38.2

### Library data of the parts
C29 = Cap_UP: Capacitor; Published: 8-Jun-2000; LatestRevisionDate: 17-Jul-2002; LatestRevisionNote: Re-released for DXP Platform.; PackageReference: RAD-0.3; Publisher: Altium Limited
F2 = F6A
LED10 LED11 = Diode: as LED1 on sheet NRF; Published: 8-Jun-2000; Datasheet: Latest Revision: 1998; Package Reference: DO-41; Publisher: Altium Limited
P3 = Header 6: Header, 6-Pin; LatestRevisionDate: 17-Jul-2002; LatestRevisionNote: Re-released for DXP Platform.; Publisher: Altium Limited
R35-R38 = Res: Semiconductor Resistor; Published: 8-Jun-2000; LatestRevisionDate: 17-Jul-2002; LatestRevisionNote: Re-released for DXP Platform.; PackageReference: AXIAL-0.5; Publisher: Altium Limited

## Sheet M1.SchDoc
size A
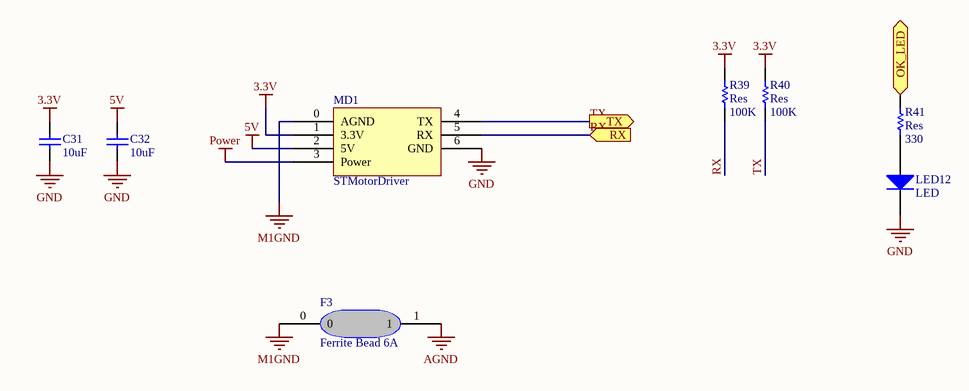
[diagram p14: M1.SchDoc]

### Parts
C31  value 10uF  [2012[0805]]  (hidden comment: Cap_UP)
C32  value 10uF  [2012[0805]]  (hidden comment: Cap_UP)
F3  Ferrite Bead 6A  [f6A]
LED12  LED  [2012[0805]]
MD1  STMotorDriver  [MotorDriver]
R39  Res  value 100K  [2012[0805]]
R40  Res  value 100K  [2012[0805]]
R41  Res  value 330  [2012[0805]]

### Ports
OK_LED (in), RX (in), TX (out)

### Nets
3.3V: C31.2 MD1.1(3.3V) R39.2 R40.2
5V: C32.2 MD1.2(5V)
AGND: F3.1
GND: C31.1 C32.1 LED12.2(K) MD1.6(GND)
M1GND: F3.0 MD1.0(AGND)
Power: MD1.3(Power)
MD1: R41.1 ; port OK_LED
RX: MD1.5(RX) R39.1 ; port RX  [project net Motor1TX]
TX: MD1.4(TX) R40.1 ; port TX  [project net Motor1RX]
NetLED12_1: LED12.1(A) R41.2

### Library data of the parts
C31 C32 = Cap_UP: Capacitor; Published: 8-Jun-2000; LatestRevisionDate: 17-Jul-2002; LatestRevisionNote: Re-released for DXP Platform.; PackageReference: RAD-0.3; Publisher: Altium Limited
F3 = F6A
LED12 = Diode: as LED1 on sheet NRF; Published: 8-Jun-2000; Datasheet: Latest Revision: 1998; Package Reference: DO-41; Publisher: Altium Limited
R39-R41 = Res: Semiconductor Resistor; Published: 8-Jun-2000; LatestRevisionDate: 17-Jul-2002; LatestRevisionNote: Re-released for DXP Platform.; PackageReference: AXIAL-0.5; Publisher: Altium Limited

## Sheet M2.SchDoc
size A
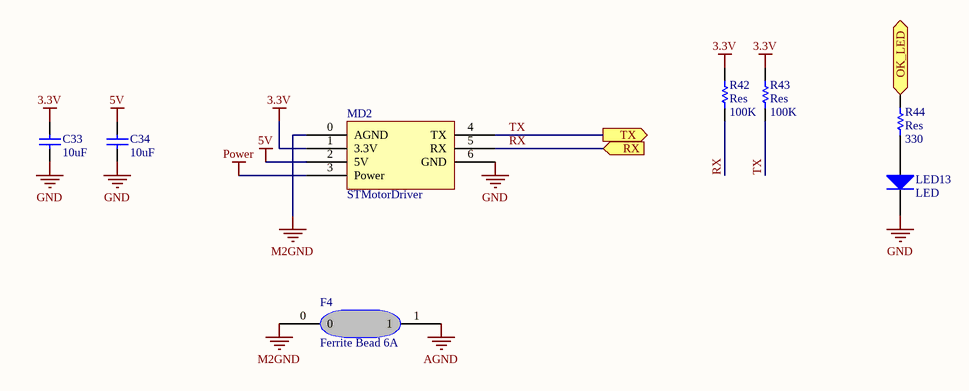
[diagram p15: M2.SchDoc]

### Parts
C33  value 10uF  [2012[0805]]  (hidden comment: Cap_UP)
C34  value 10uF  [2012[0805]]  (hidden comment: Cap_UP)
F4  Ferrite Bead 6A  [f6A]
LED13  LED  [2012[0805]]
MD2  STMotorDriver  [MotorDriver]
R42  Res  value 100K  [2012[0805]]
R43  Res  value 100K  [2012[0805]]
R44  Res  value 330  [2012[0805]]

### Ports
OK_LED (in), RX (in), TX (out)

### Nets
3.3V: C33.2 MD2.1(3.3V) R42.2 R43.2
5V: C34.2 MD2.2(5V)
AGND: F4.1
GND: C33.1 C34.1 LED13.2(K) MD2.6(GND)
M2GND: F4.0 MD2.0(AGND)
Power: MD2.3(Power)
MD2: R44.1 ; port OK_LED
RX: MD2.5(RX) R42.1 ; port RX  [project net Motor2TX]
TX: MD2.4(TX) R43.1 ; port TX  [project net Motor2RX]
NetLED13_1: LED13.1(A) R44.2

### Library data of the parts
C33 C34 = Cap_UP: Capacitor; Published: 8-Jun-2000; LatestRevisionDate: 17-Jul-2002; LatestRevisionNote: Re-released for DXP Platform.; PackageReference: RAD-0.3; Publisher: Altium Limited
F4 = F6A
LED13 = Diode: as LED1 on sheet NRF; Published: 8-Jun-2000; Datasheet: Latest Revision: 1998; Package Reference: DO-41; Publisher: Altium Limited
R42-R44 = Res: Semiconductor Resistor; Published: 8-Jun-2000; LatestRevisionDate: 17-Jul-2002; LatestRevisionNote: Re-released for DXP Platform.; PackageReference: AXIAL-0.5; Publisher: Altium Limited

## Sheet M3.SchDoc
size A
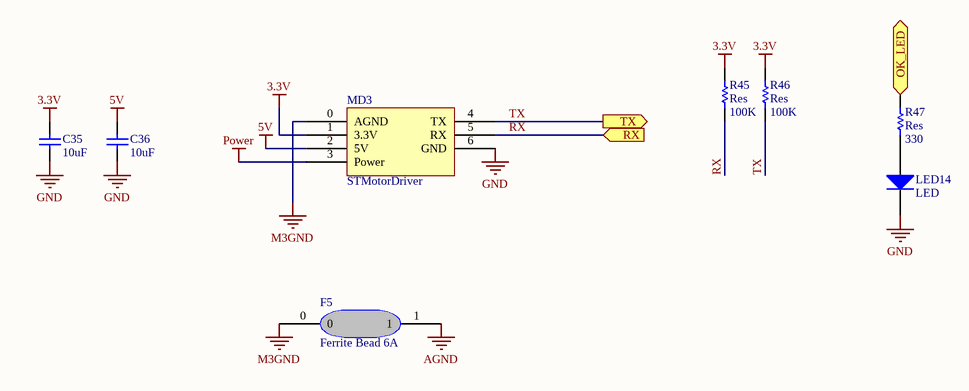
[diagram p16: M3.SchDoc]

### Parts
C35  value 10uF  [2012[0805]]  (hidden comment: Cap_UP)
C36  value 10uF  [2012[0805]]  (hidden comment: Cap_UP)
F5  Ferrite Bead 6A  [f6A]
LED14  LED  [2012[0805]]
MD3  STMotorDriver  [MotorDriver]
R45  Res  value 100K  [2012[0805]]
R46  Res  value 100K  [2012[0805]]
R47  Res  value 330  [2012[0805]]

### Ports
OK_LED (in), RX (in), TX (out)

### Nets
3.3V: C35.2 MD3.1(3.3V) R45.2 R46.2
5V: C36.2 MD3.2(5V)
AGND: F5.1
GND: C35.1 C36.1 LED14.2(K) MD3.6(GND)
M3GND: F5.0 MD3.0(AGND)
Power: MD3.3(Power)
MD3: R47.1 ; port OK_LED
RX: MD3.5(RX) R45.1 ; port RX  [project net Motor3TX]
TX: MD3.4(TX) R46.1 ; port TX  [project net Motor3RX]
NetLED14_1: LED14.1(A) R47.2

### Library data of the parts
C35 C36 = Cap_UP: Capacitor; Published: 8-Jun-2000; LatestRevisionDate: 17-Jul-2002; LatestRevisionNote: Re-released for DXP Platform.; PackageReference: RAD-0.3; Publisher: Altium Limited
F5 = F6A
LED14 = Diode: as LED1 on sheet NRF; Published: 8-Jun-2000; Datasheet: Latest Revision: 1998; Package Reference: DO-41; Publisher: Altium Limited
R45-R47 = Res: Semiconductor Resistor; Published: 8-Jun-2000; LatestRevisionDate: 17-Jul-2002; LatestRevisionNote: Re-released for DXP Platform.; PackageReference: AXIAL-0.5; Publisher: Altium Limited

## Sheet M4.SchDoc
size A
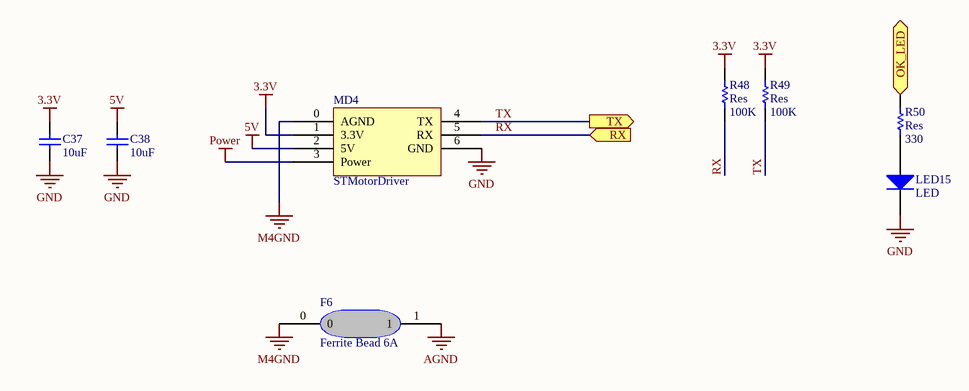
[diagram p17: M4.SchDoc]

### Parts
C37  value 10uF  [2012[0805]]  (hidden comment: Cap_UP)
C38  value 10uF  [2012[0805]]  (hidden comment: Cap_UP)
F6  Ferrite Bead 6A  [f6A]
LED15  LED  [2012[0805]]
MD4  STMotorDriver  [MotorDriver]
R48  Res  value 100K  [2012[0805]]
R49  Res  value 100K  [2012[0805]]
R50  Res  value 330  [2012[0805]]

### Ports
OK_LED (in), RX (in), TX (out)

### Nets
3.3V: C37.2 MD4.1(3.3V) R48.2 R49.2
5V: C38.2 MD4.2(5V)
AGND: F6.1
GND: C37.1 C38.1 LED15.2(K) MD4.6(GND)
M4GND: F6.0 MD4.0(AGND)
Power: MD4.3(Power)
MD4: R50.1 ; port OK_LED
RX: MD4.5(RX) R48.1 ; port RX  [project net Motor4TX]
TX: MD4.4(TX) R49.1 ; port TX  [project net Motor4RX]
NetLED15_1: LED15.1(A) R50.2

### Library data of the parts
C37 C38 = Cap_UP: Capacitor; Published: 8-Jun-2000; LatestRevisionDate: 17-Jul-2002; LatestRevisionNote: Re-released for DXP Platform.; PackageReference: RAD-0.3; Publisher: Altium Limited
F6 = F6A
LED15 = Diode: as LED1 on sheet NRF; Published: 8-Jun-2000; Datasheet: Latest Revision: 1998; Package Reference: DO-41; Publisher: Altium Limited
R48-R50 = Res: Semiconductor Resistor; Published: 8-Jun-2000; LatestRevisionDate: 17-Jul-2002; LatestRevisionNote: Re-released for DXP Platform.; PackageReference: AXIAL-0.5; Publisher: Altium Limited

## Sheet Spinn.SchDoc
size A
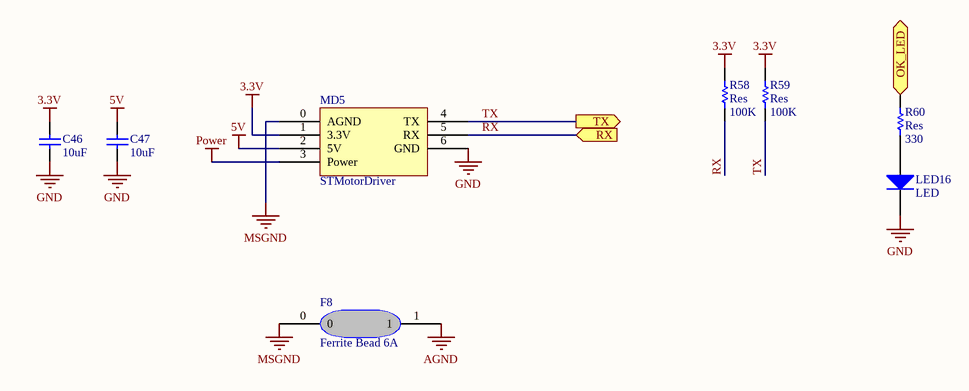
[diagram p18: Spinn.SchDoc]

### Parts
C46  value 10uF  [2012[0805]]  (hidden comment: Cap_UP)
C47  value 10uF  [2012[0805]]  (hidden comment: Cap_UP)
F8  Ferrite Bead 6A  [f6A]
LED16  LED  [2012[0805]]
MD5  STMotorDriver  [MotorDriver]
R58  Res  value 100K  [2012[0805]]
R59  Res  value 100K  [2012[0805]]
R60  Res  value 330  [2012[0805]]

### Ports
OK_LED (in), RX (in), TX (out)

### Nets
3.3V: C46.2 MD5.1(3.3V) R58.2 R59.2
5V: C47.2 MD5.2(5V)
AGND: F8.1
GND: C46.1 C47.1 LED16.2(K) MD5.6(GND)
MSGND: F8.0 MD5.0(AGND)
Power: MD5.3(Power)
MDSpinn: R60.1 ; port OK_LED
RX: MD5.5(RX) R58.1 ; port RX
TX: MD5.4(TX) R59.1 ; port TX  [project net SpinnRX]
NetLED16_1: LED16.1(A) R60.2

### Library data of the parts
C46 C47 = Cap_UP: Capacitor; Published: 8-Jun-2000; LatestRevisionDate: 17-Jul-2002; LatestRevisionNote: Re-released for DXP Platform.; PackageReference: RAD-0.3; Publisher: Altium Limited
F8 = F6A
LED16 = Diode: as LED1 on sheet NRF; Published: 8-Jun-2000; Datasheet: Latest Revision: 1998; Package Reference: DO-41; Publisher: Altium Limited
R58-R60 = Res: Semiconductor Resistor; Published: 8-Jun-2000; LatestRevisionDate: 17-Jul-2002; LatestRevisionNote: Re-released for DXP Platform.; PackageReference: AXIAL-0.5; Publisher: Altium Limited

## Sheet Power.SchDoc
size A
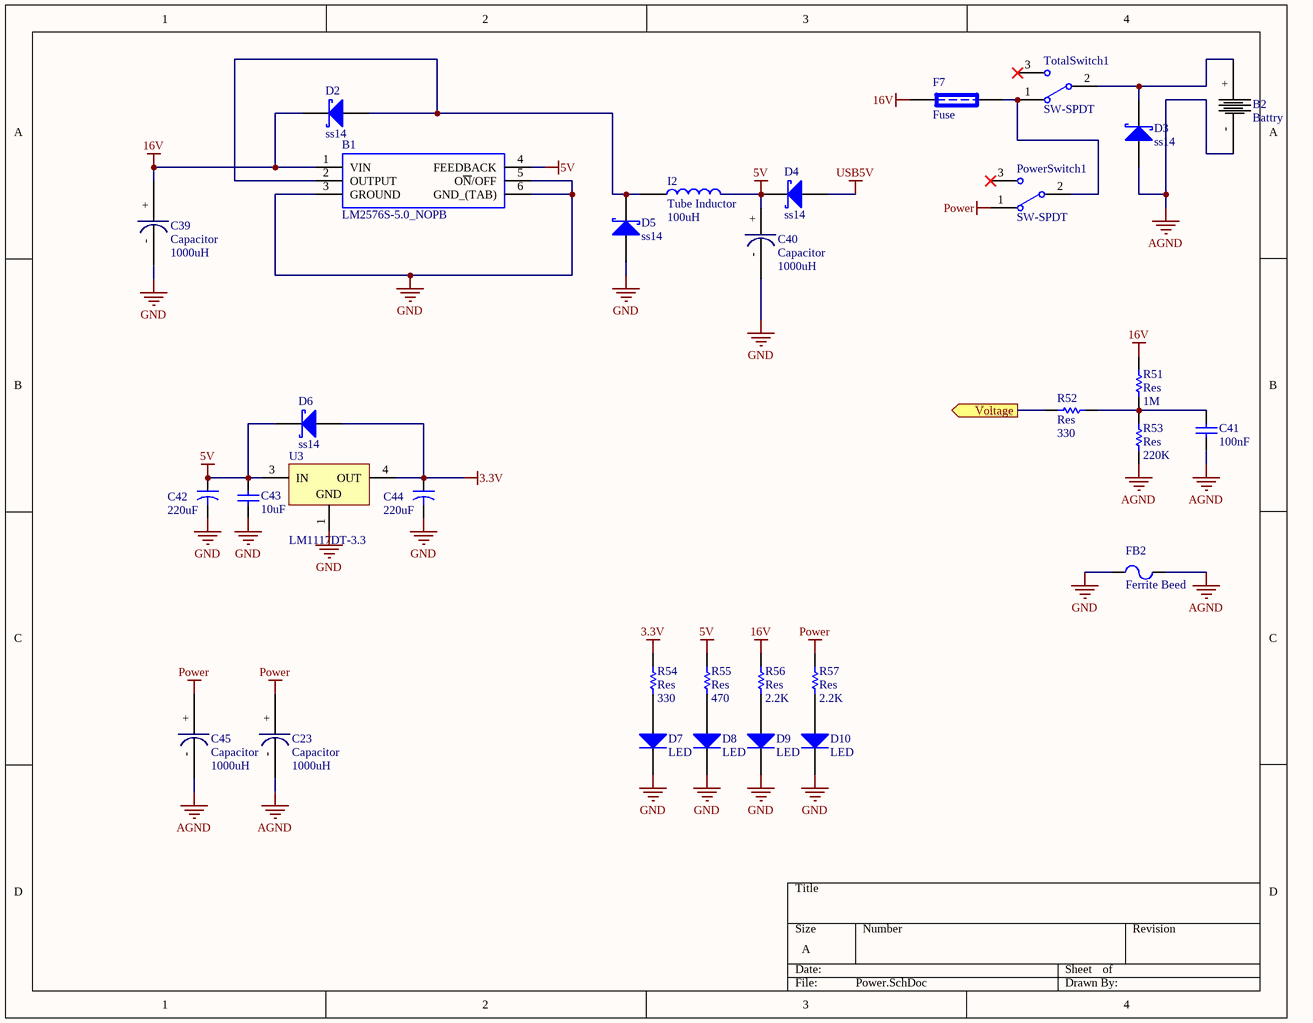
[diagram p19: Power.SchDoc]

### Parts
B1  LM2576S-5.0_NOPB  [TO170P1435X465-6N]
B2  Battry  [Battry]
C23  Capacitor  Capacitance: 1000uH  [DIPCap]
C39  Capacitor  Capacitance: 1000uH  [DIPCap]
C40  Capacitor  Capacitance: 1000uH  [DIPCap]
C41  value 100nF  [2012[0805]]  (hidden comment: Cap_UP)
C42  value 220uF  [7343]  (hidden comment: Cap_El)
C43  value 10uF  [2012[0805]]  (hidden comment: Cap_UP)
C44  value 220uF  [7343]  (hidden comment: Cap_El)
C45  Capacitor  Capacitance: 1000uH  [DIPCap]
D2  ss14  [US1m]
D3  ss14  [US1m]
D4  ss14  [US1m]
D5  ss14  [US1m]
D6  ss14  [US1m]
D7  LED  [2012[0805]]
D8  LED  [2012[0805]]
D9  LED  [2012[0805]]
D10  LED  [2012[0805]]
F7  Fuse  [3216[1206]]
FB2  Ferrite Beed  [3216[1206]]
I2  Tube Inductor  Inductance: 100uH  [Tube_Inductor]
PowerSwitch1  SW-SPDT  [KEYKHRAB]
R51  Res  value 1M  [2012[0805]]
R52  Res  value 330  [2012[0805]]
R53  Res  value 220K  [2012[0805]]
R54  Res  value 330  [2012[0805]]
R55  Res  value 470  [2012[0805]]
R56  Res  value 2.2K  [2012[0805]]
R57  Res  value 2.2K  [2012[0805]]
TotalSwitch1  SW-SPDT  [KEYKHRAB]
U3  LM1117DT-3.3  [SOT223]

### Ports
Voltage (out)

### Nets
3.3V: C44.1 D6.1(A) R54.2 U3.4(OUT)
5V: B1.4(FEEDBACK) C40.+ C42.1 C43.2 D4.2(K) D6.2(K) I2.1 R55.2 U3.3(IN)
16V: B1.1(VIN) C39.+ D2.2(K) F7.1 R51.2 R56.2
AGND: B2.- C23.- C41.1 C45.- D3.1(A) FB2.2 R53.1
GND: B1.3(GROUND) B1.5(O~{N}/OFF) B1.6(GND_(TAB)) C39.- C40.- C42.2 C43.1 C44.2 D5.1(A) D7.2(K) D8.2(K) D9.2(K) D10.2(K) FB2.1 U3.1(GND)
Power: C23.+ C45.+ PowerSwitch1.1 R57.2
USB5V: D4.1(A)
Voltage: R52.1 ; port Voltage
NetB1_2: B1.2(OUTPUT) D2.1(A) D5.2(K) I2.0
NetB2_+: B2.+ D3.2(K) TotalSwitch1.2
NetC41_2: C41.2 R51.1 R52.2 R53.2
NetD7_1: D7.1(A) R54.1
NetD8_1: D8.1(A) R55.1
NetD9_1: D9.1(A) R56.1
NetD10_1: D10.1(A) R57.1
NetF7_2: F7.2 PowerSwitch1.2 TotalSwitch1.1

Not connected (* = marked no-connect by the designer): PowerSwitch1 3(1)*; TotalSwitch1 3(1)*

### Library data of the parts
B1 = LM2576S-5.0_NOPB: SIMPLE SWITCHER 40V, 3A Low Component Count Step-Down Regulator; Manufacturer_Name: Texas Instruments; Manufacturer_Part_Number: LM2576S-5.0/NOPB; Geometry.Height: 4.65mm; Supplier_Name: RS; RS Part Number: 5333226P; Allied_Number: *; Other Part Number: *; Datasheet Link: http://docs-europe.electrocomponents.com/webdocs/0780/0900766b80780107.pdf; 3D Package: *
C23 C39 C40 C45 = DIPCap
C41 C43 = Cap_UP: Capacitor; Published: 8-Jun-2000; LatestRevisionDate: 17-Jul-2002; LatestRevisionNote: Re-released for DXP Platform.; PackageReference: RAD-0.3; Publisher: Altium Limited
C42 C44 = Cap_El: Capacitor; Published: 23-Sep-2002; PackageReference: CAPR5-4X5; Publisher: Altium Limited
D2-D6 = D Schottky: Schottky Diode; Published: 8-Jun-2000; LatestRevisionDate: 17-Jul-2002; LatestRevisionNote: Re-released for DXP Platform.; PackageReference: SMB; Publisher: Altium Limited; PackageDescription: DO-214-AA/SMB; 2 C-Bend Leads; Body 5.3 x 3.6 mm, inc. leads (LxW); Code_JEDEC: DO-214-AA
D7-D10 = Diode: as LED1 on sheet NRF; Published: 8-Jun-2000; Datasheet: Latest Revision: 1998; Package Reference: DO-41; Publisher: Altium Limited
FB2 = Ferrite Beed: Code_IEC: 1005; Published: 8-Jun-2000; LatestRevisionDate: 17-Jul-2002; LatestRevisionNote: Re-released for DXP Platform.; PackageReference: 0402-A; Publisher: Altium Limited; Code_JEITA: 0402
I2 = Tube_Inductor
PowerSwitch1 TotalSwitch1 = SW-SPDT: SPDT Subminiature Toggle Switch, Right Angle Mounting, Vertical Actuation; Published: 24-Mar-1999; LatestRevisionDate: 17-Dec-2003; LatestRevisionNote: Schematic revised, PCB Footprint replaced.; DatasheetDocument: 05-Dec-2000; PackageReference: TL36WW15050; Publisher: Altium Limited; ComponentLink1Description: Manufacturer Link; ComponentLink1URL: http://www.apem.com
R51-R57 = Res: Semiconductor Resistor; Published: 8-Jun-2000; LatestRevisionDate: 17-Jul-2002; LatestRevisionNote: Re-released for DXP Platform.; PackageReference: AXIAL-0.5; Publisher: Altium Limited
U3 = LM1117DT-3.3: 800mA Low-Dropout Linear Regulator, 3-pin TO-252; Manufacturer: National Semiconductor; PackageTopMarking: NSUZXYTT*LM1117*DT-3.3; PowerWise: N; CompType: LDO IC; Published: 4-Dec-2008; DatasheetVersion: Apr-2006; PackageVersion: revD, Feb-2009; PackageReference: TD03B; Publisher: Altium Limited; PackageDescription: TO252, Molded, Jedec, 6.8 x 6.10 x 2.30mm Body, 3 Lead, 2.28mm Pitch, Surface Mount; Supplier 1: Farnell; Supplier Part Number 1: 9486275; Supplier 2: Farnell; Supplier Part Number 2: 1523829; PartNumber: LM1117DT-3.3; RoHS: N; PinCount: 3; Code_JEDEC: TO-252-AA; ComponentLink1Description: LM1117 Datasheet; ComponentLink1URL: http://www.national.com/ds/LM/LM1117.pdf; ComponentLink2Description: LM1117 Web Page; ComponentLink2URL: http://www.national.com/pf/LM/LM1117.html; ComponentLink3Description: TD03B Package Page; ComponentLink3URL: http://www.national.com/packaging/folders/td03b.html
F7 = Fuse: Published: 8-Jun-2000; LatestRevisionDate: 17-Jul-2002; LatestRevisionNote: Re-released for DXP Platform.; PackageReference: PIN-W2/E2.8; Publisher: Altium Limited

## Nets that join several sheets
3.3V: Processor (18 pins), STLink (5 pins), Boot (C16.1), Reset (R5.1), HexSwitch (S2.2 S2.5), NRF (6 pins), USB (R18.1), IMU (C24.2 I1.1 R26.2 R27.2), Button (R30.1), Debug (C26.2 P2.2 R31.2 R32.2), Shoot (C29.2 P3.4 R35.2 R36.2), M1 (C31.2 MD1.1 R39.2 R40.2), M2 (C33.2 MD2.1 R42.2 R43.2), M3 (C35.2 MD3.1 R45.2 R46.2), M4 (C37.2 MD4.1 R48.2 R49.2), Spinn (C46.2 MD5.1 R58.2 R59.2), Power (C44.1 D6.1 R54.2 U3.4)
5V: Buzzer (Jumper_BUZ1.2), Debug (C27.2 P2.1), M1 (C32.2 MD1.2), M2 (C34.2 MD2.2), M3 (C36.2 MD3.2), M4 (C38.2 MD4.2), Spinn (C47.2 MD5.2), Power (9 pins)
AGND: Shoot (F2.0), M1 (F3.1), M2 (F4.1), M3 (F5.1), M4 (F6.1), Spinn (F8.1), Power (7 pins)
GND: Processor (19 pins), STLink (C15.1 P1.3), Boot (R4.2), Reset (C17.1 S1.2), Xtal (C18.2 C19.2), HexSwitch (R7.1 R8.1 R9.1 R10.1), Buzzer (Q1.3), NRF (5 pins), USB (9 pins), IMU (C24.1 I1.2 LED7.2), Button (C25.1 S3.2), Debug (5 pins), Shoot (C29.1 LED10.2 LED11.2 P3.1), M1 (C31.1 C32.1 LED12.2 MD1.6), M2 (C33.1 C34.1 LED13.2 MD2.6), M3 (C35.1 C36.1 LED14.2 MD3.6), M4 (C37.1 C38.1 LED15.2 MD4.6), Spinn (C46.1 C47.1 LED16.2 MD5.6), Power (15 pins)
Power: Shoot (P3.5), M1 (MD1.3), M2 (MD2.3), M3 (MD3.3), M4 (MD4.3), Spinn (MD5.3), Power (C23.+ C45.+ PowerSwitch1.1 R57.2)
USB5V: USB (F1.2 R20.1 R23.1), Power (D4.1)
BOOT: Processor (U1.94), Boot (C16.2 R4.1)
Button: Processor (U1.29), Button (R29.2)
Buzzer: Processor (U1.5), Buzzer (Q1.2)
CE: Processor (U1.48), NRF (U2.3)
CSN: Processor (U1.51), NRF (R14.1 U2.4)
DataArrived: Processor (U1.88), NRF (R16.1)
DataCorrect: Processor (U1.85), NRF (R15.1)
DebugReceive: Processor (U1.84), Debug (R33.1)
DebugSCL: Processor (U1.67), Debug (P2.4 R32.1)
DebugSDA: Processor (U1.66), Debug (P2.3 R31.1)
DebugTransmit: Processor (U1.82), Debug (R34.1)
DM: Processor (U1.70), USB (D1.3)
DP: Processor (U1.71), USB (D1.1)
HEX0: Processor (U1.3), HexSwitch (R10.2 S2.1)
HEX1: Processor (U1.1), HexSwitch (R9.2 S2.4)
HEX2: Processor (U1.4), HexSwitch (R8.2 S2.3)
HEX3: Processor (U1.2), HexSwitch (R7.2 S2.6)
IMUOK: Processor (U1.61), IMU (R28.1)
IMUSCL: Processor (U1.95), IMU (I1.3 R27.1)
IMUSDA: Processor (U1.96), IMU (I1.4 R26.1)
IRQ: Processor (U1.55), NRF (U2.8)
MD1: Processor (U1.97), M1 (R41.1)
MD2: Processor (U1.98), M2 (R44.1)
MD3: Processor (U1.58), M3 (R47.1)
MD4: Processor (U1.60), M4 (R50.1)
MDSpinn: Processor (U1.81), Spinn (R60.1)
MISO: Processor (U1.53), NRF (R12.1 U2.7)
MOSI: Processor (U1.54), NRF (R13.1 U2.6)
Motor1RX: Processor (U1.93), M1 (MD1.4 R40.1)
Motor1TX: Processor (U1.92), M1 (MD1.5 R39.1)
Motor2RX: Processor (U1.24), M2 (MD2.4 R43.1)
Motor2TX: Processor (U1.23), M2 (MD2.5 R42.1)
Motor3RX: Processor (U1.64), M3 (MD3.4 R46.1)
Motor3TX: Processor (U1.63), M3 (MD3.5 R45.1)
Motor4RX: Processor (U1.79), M4 (MD4.4 R49.1)
Motor4TX: Processor (U1.78), M4 (MD4.5 R48.1)
NRFOK: Processor (U1.18), NRF (R17.1)
NRFSCK: Processor (U1.52), NRF (R11.1 U2.5)
NRST: Processor (U1.14), STLink (P1.5), Reset (C17.2 R5.2 S1.1)
OSC_IN: Processor (U1.12), Xtal (C18.1 Y1.2)
OSC_OUT: Processor (U1.13), Xtal (C19.1 Y1.1)
RX: Processor (U1.80), Shoot (P3.3 R35.1)
RX: Processor (U1.86), Spinn (MD5.5 R58.1)
ShootIsCharged: Processor (U1.91), Shoot (R38.1)
ShootOK: Processor (U1.90), Shoot (R37.1)
ShootRX: Processor (U1.83), Shoot (P3.2 R36.1)
SpinnRX: Processor (U1.87), Spinn (MD5.4 R59.1)
SWCLK: Processor (U1.76), STLink (P1.2 R1.1)
SWDIO: Processor (U1.72), STLink (P1.4 R2.1)
SWO: Processor (U1.89), STLink (P1.6 R3.1)
USBEnable: Processor (U1.59), USB (R19.1)
USBReceive: Processor (U1.62), USB (R24.1)
USBTransmit: Processor (U1.65), USB (R25.1)
Voltage: Processor (U1.30), Power (R52.1)